# Altium schematic sheet Power_PMIC.SchDoc: Power PMIC
size A3; Date: Not used; ApprovedBy: Not used; CheckedBy: Not used; Author: Not used; CompanyName: STMicroelectronics; DrawnBy: Not used; Engineer: Not used; Organization: Not used; Address1: Not used; Address2: Not used; Address3: Not used; Address4: Not used; DocumentNumber: Not used; Revision: Not used; SheetNumber: 4; SheetTotal: 18; CurrentTime: Not used; CurrentDate: Not used; Time: Not used; DocumentFullPathAndName: Not used; DocumentName: Not used; ModifiedDate: Not used; ImagePath: Not used; ProjectName: Not used; Application_BuildNumber: Not used
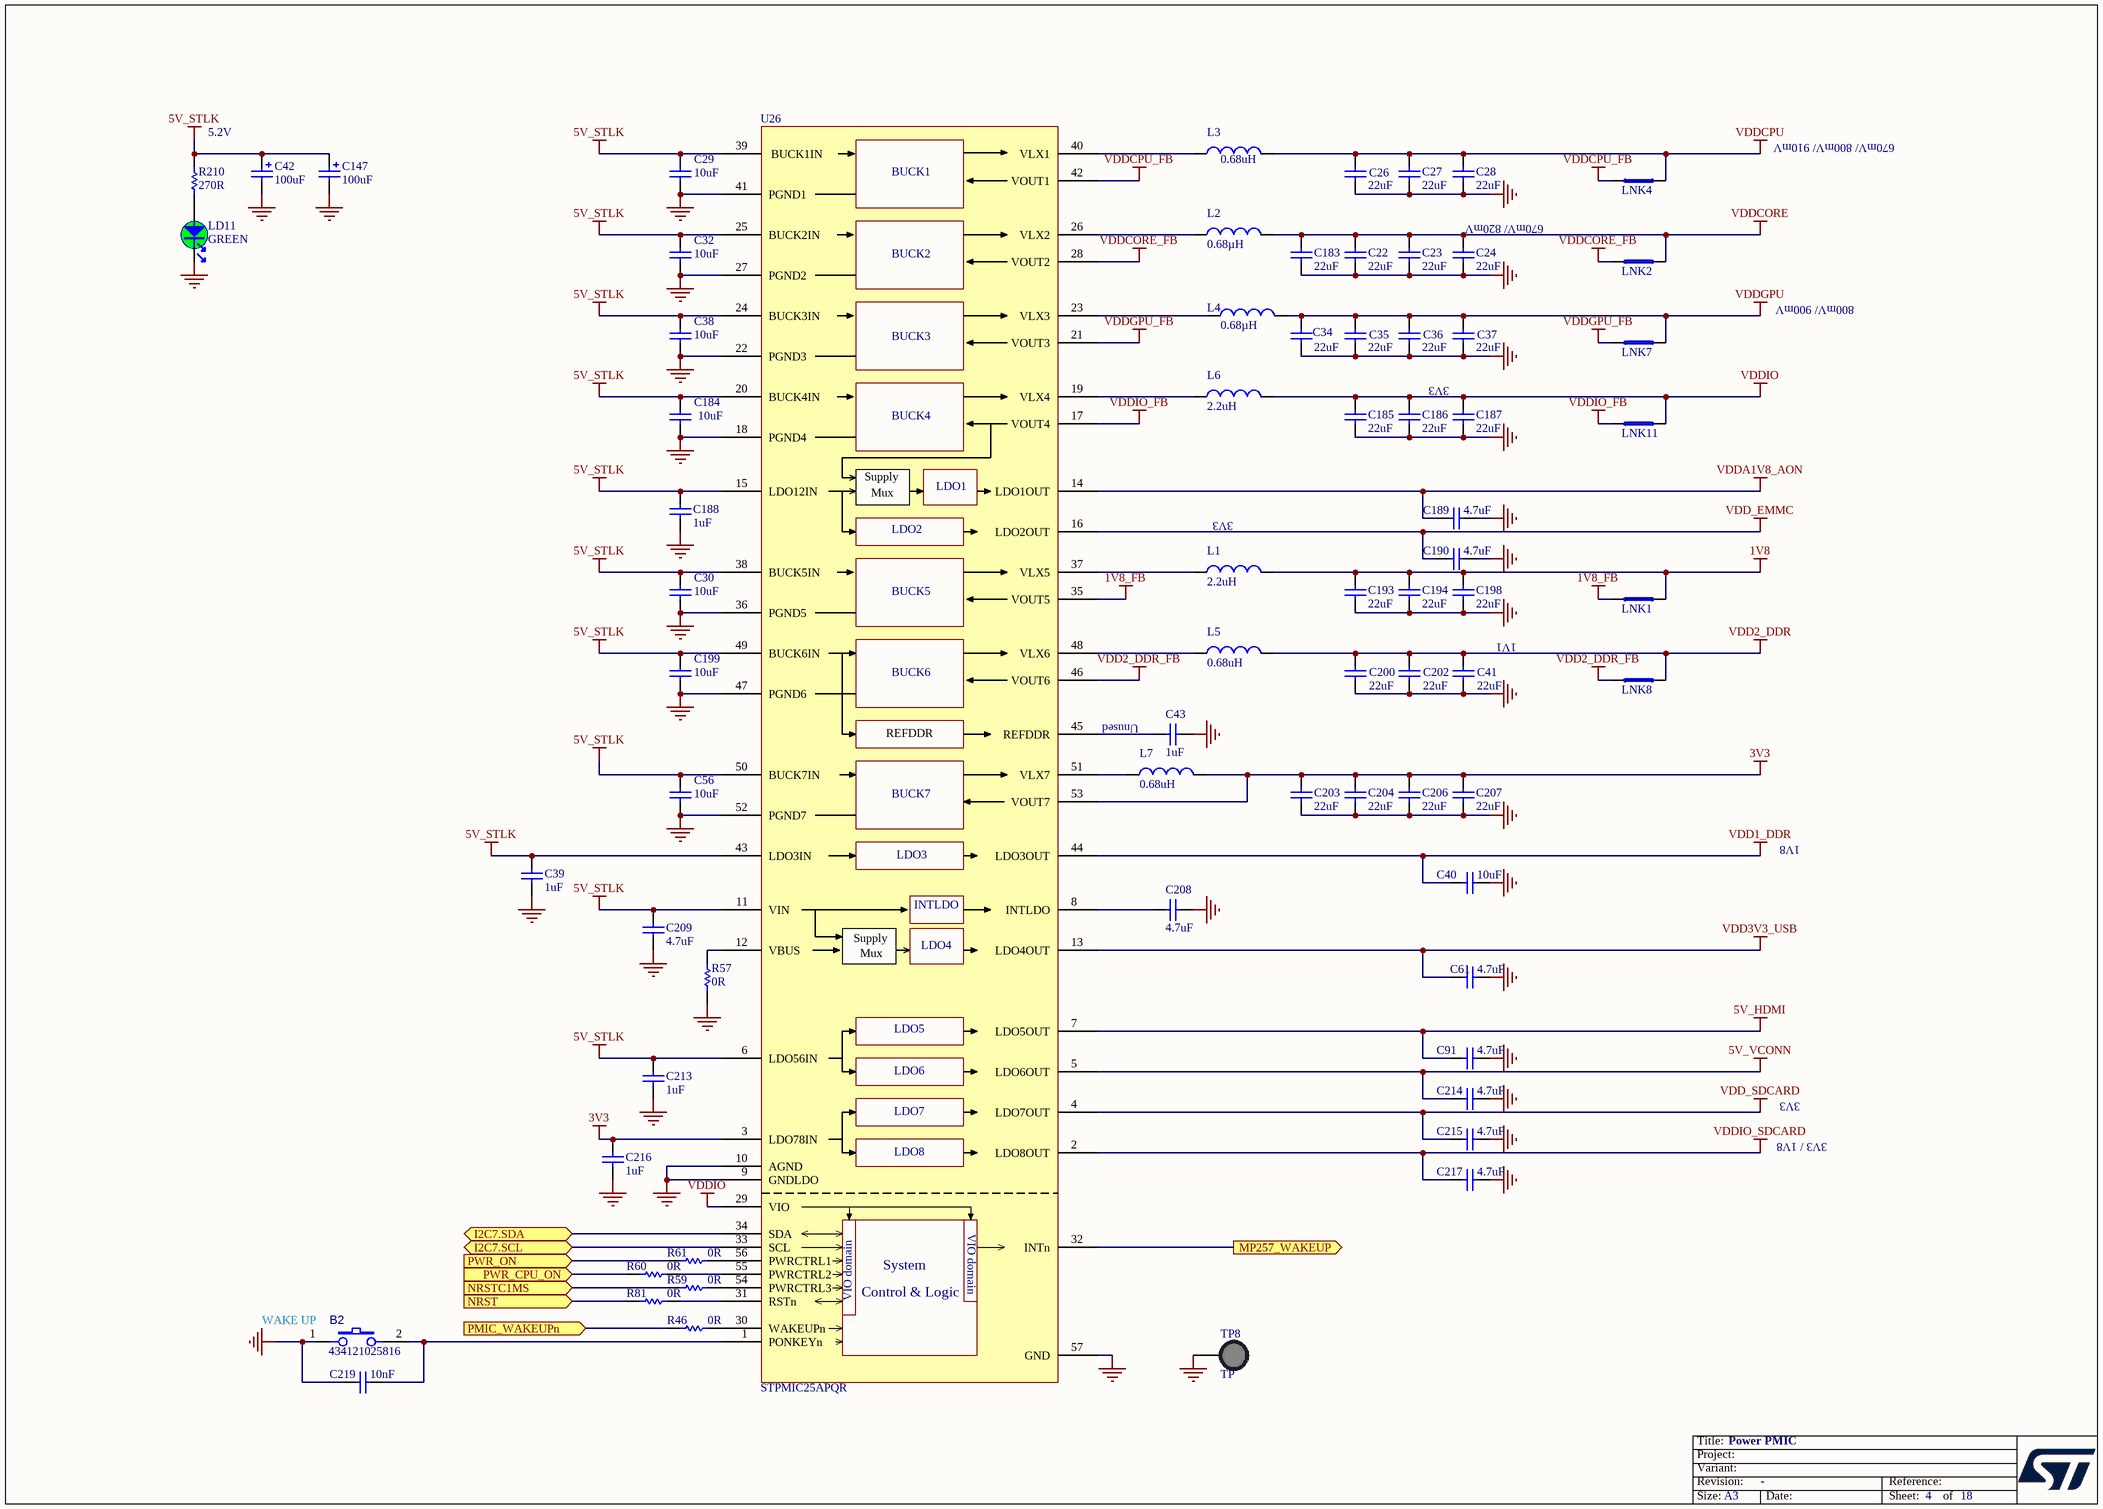
[diagram p0: Power_PMIC.SchDoc]

## Parts
B2  value 434121025816  [SWI_WE_434121025816]  (hidden comment: SW_PUSH_SMD_2P)
C22  value 22uF  [C0603]  (hidden comment: Capacitor)
C23  value 22uF  [C0603]  (hidden comment: Capacitor)
C24  value 22uF  [C0603]  (hidden comment: Capacitor)
C26  value 22uF  [C0603]  (hidden comment: Capacitor)
C27  value 22uF  [C0603]  (hidden comment: Capacitor)
C28  value 22uF  [C0603]  (hidden comment: Capacitor)
C29  value 10uF  [C0603]  (hidden comment: Capacitor)
C30  value 10uF  [C0603]  (hidden comment: Capacitor)
C32  value 10uF  [C0603]  (hidden comment: Capacitor)
C34  value 22uF  [C0603]  (hidden comment: Capacitor)
C35  value 22uF  [C0603]  (hidden comment: Capacitor)
C36  value 22uF  [C0603]  (hidden comment: Capacitor)
C37  value 22uF  [C0603]  (hidden comment: Capacitor)
C38  value 10uF  [C0603]  (hidden comment: Capacitor)
C39  value 1uF  [C0402]  (hidden comment: Capacitor)
C40  value 10uF  [C0402]  (hidden comment: Capacitor)
C41  value 22uF  [C0603]  (hidden comment: Capacitor)
C42  value 100uF  [CPOL_TCJ-B_1210_H210]  (hidden comment: Cap_POL_TANA)
C43  value 1uF  [C0402]  (hidden comment: Capacitor)
C56  value 10uF  [C0603]  (hidden comment: Capacitor)
C61  value 4.7uF  [C0402]  (hidden comment: Capacitor)
C91  value 4.7uF  [C0402]  (hidden comment: Capacitor)
C147  value 100uF  [CPOL_TCJ-B_1210_H210]  (hidden comment: Cap_POL_TANA)
C183  value 22uF  [C0603]  (hidden comment: Capacitor)
C184  value 10uF  [C0603]  (hidden comment: Capacitor)
C185  value 22uF  [C0805]  (hidden comment: Capacitor)
C186  value 22uF  [C0805]  (hidden comment: Capacitor)
C187  value 22uF  [C0805]  (hidden comment: Capacitor)
C188  value 1uF  [C0402]  (hidden comment: Capacitor)
C189  value 4.7uF  [C0402]  (hidden comment: Capacitor)
C190  value 4.7uF  [C0402]  (hidden comment: Capacitor)
C193  value 22uF  [C0805]  (hidden comment: Capacitor)
C194  value 22uF  [C0805]  (hidden comment: Capacitor)
C198  value 22uF  [C0805]  (hidden comment: Capacitor)
C199  value 10uF  [C0603]  (hidden comment: Capacitor)
C200  value 22uF  [C0603]  (hidden comment: Capacitor)
C202  value 22uF  [C0603]  (hidden comment: Capacitor)
C203  value 22uF  [C0805]  (hidden comment: Capacitor)
C204  value 22uF  [C0805]  (hidden comment: Capacitor)
C206  value 22uF  [C0805]  (hidden comment: Capacitor)
C207  value 22uF  [C0805]  (hidden comment: Capacitor)
C208  value 4.7uF  [C0402]  (hidden comment: Capacitor)
C209  value 4.7uF  [C0402]  (hidden comment: Capacitor)
C213  value 1uF  [C0402]  (hidden comment: Capacitor)
C214  value 4.7uF  [C0402]  (hidden comment: Capacitor)
C215  value 4.7uF  [C0402]  (hidden comment: Capacitor)
C216  value 1uF  [C0402]  (hidden comment: Capacitor)
C217  value 4.7uF  [C0402]  (hidden comment: Capacitor)
C219  value 10nF  [C0402]  (hidden comment: Capacitor)
L1  value 2.2uH  [IND_2016_MURATA_LQM2MPN2R2NG0]  (hidden comment: Inductor)
L2  value 0.68µH  [IND_2520_TOKO_DFE252012P]  (hidden comment: Inductor)
L3  value 0.68uH  [IND_2016_MURATA_LQM2MPN2R2NG0]  (hidden comment: Inductor)
L4  value 0.68µH  [IND_2520_TOKO_DFE252012P]  (hidden comment: Inductor)
L5  value 0.68uH  [IND_2016_MURATA_LQM2MPN2R2NG0]  (hidden comment: Inductor)
L6  value 2.2uH  [IND_2016_MURATA_LQM2MPN2R2NG0]  (hidden comment: Inductor)
L7  value 0.68uH  [IND_2016_MURATA_LQM2MPN2R2NG0]  (hidden comment: Inductor)
LD11  value GREEN  [LED_0603_OSRAM_LG-Q396-PS-35_GREEN_1A2K_H0P4]  (hidden comment: LED_green)
LNK1  link_200  [LINK200]  (value not drawn)  (no BOM)
LNK2  link_200  [LINK200]  (value not drawn)  (no BOM)
LNK4  link_200  [LINK200]  (value not drawn)  (no BOM)
LNK7  link_200  [LINK200]  (value not drawn)  (no BOM)
LNK8  link_200  [LINK200]  (value not drawn)  (no BOM)
LNK11  link_200  [LINK200]  (value not drawn)  (no BOM)
R46  value 0R  [R0402]
R57  value 0R  [R0402]
R59  value 0R  [R0402]
R60  value 0R  [R0402]
R61  value 0R  [R0402]
R81  value 0R  [R0402]
R210  value 270R  [R0402]  (hidden comment: Resistor)
TP8  value TP  [TP_PTH-1P02MM_TEST-TERMINAL_RS_101-2391_BLACK]  (hidden comment: Test_pin_conn_black)
U26  STPMIC25APQR  [ICC_QFN56-EPAD_6P5X6P5_P040]

## Ports
I2C7.SCL (bidir), I2C7.SDA (bidir), MP257_WAKEUP (out), NRST (in), NRSTC1MS (in), PMIC_WAKEUPn (in), PWR_CPU_ON (in), PWR_ON (in)

## Nets
1V8: C193.2 C194.2 C198.2 L1.2 LNK1.2
1V8_FB: LNK1.1 U26.35(VOUT5)
3V3: C203.2 C204.2 C206.2 C207.2 C216.2 L7.2 U26.3(LDO78IN) U26.53(VOUT7)
5V_HDMI: C91.1 U26.7(LDO5OUT)
5V_STLK: C29.2 C30.2 C32.2 C38.2 C39.2 C42.1 C56.2 C147.1 C184.2 C188.2 C199.2 C209.2 C213.2 R210.1 U26.6(LDO56IN) U26.11(VIN) U26.15(LDO12IN) U26.20(BUCK4IN) U26.24(BUCK3IN) U26.25(BUCK2IN) U26.38(BUCK5IN) U26.39(BUCK1IN) U26.43(LDO3IN) U26.49(BUCK6IN) U26.50(BUCK7IN)
5V_VCONN: C214.1 U26.5(LDO6OUT)
GND: B2.1 C22.1 C23.1 C24.1 C26.1 C27.1 C28.1 C29.1 C30.1 C32.1 C34.1 C35.1 C36.1 C37.1 C38.1 C39.1 C40.1 C41.1 C42.2 C43.1 C56.1 C61.1 C91.2 C147.2 C183.1 C184.1 C185.1 C186.1 C187.1 C188.1 C189.1 C190.2 C193.1 C194.1 C198.1 C199.1 C200.1 C202.1 C203.1 C204.1 C206.1 C207.1 C208.2 C209.1 C213.1 C214.2 C215.2 C216.1 C217.2 C219.1 LD11.2 R57.1 TP8.1 U26.9(GNDLDO) U26.10(AGND) U26.18(PGND4) U26.22(PGND3) U26.27(PGND2) U26.36(PGND5) U26.41(PGND1) U26.47(PGND6) U26.52(PGND7) U26.57(GND)
VDD1_DDR: C40.2 U26.44(LDO3OUT)
VDD2_DDR: C41.2 C200.2 C202.2 L5.2 LNK8.2
VDD2_DDR_FB: LNK8.1 U26.46(VOUT6)
VDD3V3_USB: C61.2 U26.13(LDO4OUT)
VDD_EMMC: C190.1 U26.16(LDO2OUT)
VDD_SDCARD: C215.1 U26.4(LDO7OUT)
VDDA1V8_AON: C189.2 U26.14(LDO1OUT)
VDDCORE: C22.2 C23.2 C24.2 C183.2 L2.2 LNK2.2
VDDCORE_FB: LNK2.1 U26.28(VOUT2)
VDDCPU: C26.2 C27.2 C28.2 L3.2 LNK4.1
VDDCPU_FB: LNK4.2 U26.42(VOUT1)
VDDGPU: C34.2 C35.2 C36.2 C37.2 L4.2 LNK7.2
VDDGPU_FB: LNK7.1 U26.21(VOUT3)
VDDIO: C185.2 C186.2 C187.2 L6.2 LNK11.2 U26.29(VIO)
VDDIO_FB: LNK11.1 U26.17(VOUT4)
VDDIO_SDCARD: C217.1 U26.2(LDO8OUT)
I2C7.SCL: U26.33(SCL) ; port I2C7.SCL
I2C7.SDA: U26.34(SDA) ; port I2C7.SDA
MP257_WAKEUP: U26.32(INTn) ; port MP257_WAKEUP
NRST: R81.1 ; port NRST
NRSTC1MS: R59.1 ; port NRSTC1MS
PMIC_WAKEUPn: R46.1 ; port PMIC_WAKEUPn
PWR_CPU_ON: R60.1 ; port PWR_CPU_ON
PWR_ON: R61.1 ; port PWR_ON
NetB2_2: B2.2 C219.2 U26.1(PONKEYn)
NetC43_2: C43.2 U26.45(REFDDR)
NetC208_1: C208.1 U26.8(INTLDO)
NetL1_1: L1.1 U26.37(VLX5)
NetL2_1: L2.1 U26.26(VLX2)
NetL3_1: L3.1 U26.40(VLX1)
NetL4_1: L4.1 U26.23(VLX3)
NetL5_1: L5.1 U26.48(VLX6)
NetL6_1: L6.1 U26.19(VLX4)
NetL7_1: L7.1 U26.51(VLX7)
NetLD11_1: LD11.1 R210.2
NetR46_2: R46.2 U26.30(WAKEUPn)
NetR57_2: R57.2 U26.12(VBUS)
NetR59_2: R59.2 U26.54(PWRCTRL3)
NetR60_2: R60.2 U26.55(PWRCTRL2)
NetR61_2: R61.2 U26.56(PWRCTRL1)
NetR81_2: R81.2 U26.31(RSTn)

## Notes on the sheet
- 5.2V
- 670mV/ 800mV/ 910mV
- (near C24) 670mV/ 820mV
- 800mV/ 900mV
- 3V3
- (near L1) 3V3
- 1V1
- Unused
- 1V8
- 3V3 / 1V8
- (near B2) WAKE UP
- Title:
- Project:
- Size:
- Revision:
- Variant:
- A3
- -
- Date:
- Reference:
- Sheet:
- of
- (in symbol MCD-03000) BUCK1; BUCK2; BUCK3; BUCK4; Supply; LDO1; Mux; LDO2; BUCK5; BUCK6; BUCK7; LDO3; LDO4; LDO5; LDO6; LDO7; LDO8; VIO domain; System; Control & Logic

## Library data of the parts
B2 = MCD-03492: Switch tactile, SPST-NO, 50mA, 12V, 6x3.8mm; Part_Type: Misc; Part_Preference: Recommended; Manufacturer: WURTH ELEKTRONIC; Component_Country_Of_Origin: China°; ShowFields: YES; ID: 5608; Internal_Part_Number: MCD-03492; Status: Checked; Manufacturer_Part_Number: 434121025816; Package: 6x3.8mm; ComponentLink1URL: http://tunmcdsvn.tun.st.com/Component_Documentation_Library/Trunk/Misc/WURTH_ELECTRONIK_434121025816; Order_Code_Digikey: 732-7045-2-ND; Order_Code_Farnell: 1867991; Order_Code_RS: N/A
C22-C24 C26 C34-C37 C41 C200 C202 = MCD-00100: Capacitor, MLCC, 22uF, 6V3, X5R, +/-20%, 0603, T=0,8mm; Manufacturer_Part_Number: GRM188R60J226MEA0J; Manufacturer: MURATA; Part_Preference: Recommended; Component_Country_Of_Origin: Japan; ID: 2766; ShowFields: YES; Internal_Part_Number: MCD-00100; Status: Released; Part_Type: Capacitor; Package: 0603; ComponentLink1Description: Part_Information; ComponentLink1URL: http://tunmcdsvn.tun.st.com/Component_Documentation_Library/Trunk/Capacitor/MURATA_GRM_Series; Order_Code_Digikey: 490-7612-2-ND; Order_Code_Farnell: N/A; Order_Code_RS: N/A; Alternate_Manufacturer: N/A; Alternate_Manufacturer_Part_Number: N/A
C27 C28 C183 = MCD-00100: Capacitor, MLCC, 22uF, 6V3, X5R, +/-20%, 0603, T=0,8mm; Part_Preference: Recommended; Manufacturer: MURATA; Manufacturer_Part_Number: GRM188R60J226MEA0J; Component_Country_Of_Origin: Japan; ID: 2766; ShowFields: YES; Internal_Part_Number: MCD-00100; Status: Released; Part_Type: Capacitor; Package: 0603; ComponentLink1URL: http://tunmcdsvn.tun.st.com/Component_Documentation_Library/Trunk/Capacitor/MURATA_GRM_Series; Order_Code_Digikey: 490-7612-2-ND; Order_Code_Farnell: N/A; Order_Code_RS: N/A; ComponentLink1Description: Part_Information; Alternate_Manufacturer: N/A; Alternate_Manufacturer_Part_Number: N/A
C29 C30 C32 C38 C56 C184 C199 = MCD-00099: Capacitor, MLCC, 10uF, 10V, X5R, +/-10%, 0603, T=0,8mm; Manufacturer_Part_Number: GRM188R61A106KE69D; Manufacturer: MURATA; Part_Preference: Recommended; Order_Code_RS: 170-6168; Component_Country_Of_Origin: Japan; ID: 2770; ShowFields: YES; Internal_Part_Number: MCD-00099; Status: Released; Part_Type: Capacitor; Package: 0603; ComponentLink1Description: Part_Information; ComponentLink1URL: http://tunmcdsvn.tun.st.com/Component_Documentation_Library/Trunk/Capacitor/MURATA_GRM_Series; Order_Code_Digikey: 490-10474-1-ND; Order_Code_Farnell: 2494233; Alternate_Manufacturer: N/A; Alternate_Manufacturer_Part_Number: N/A
C39 C43 C188 C213 C216 = MCD-00095: Capacitor, MLCC, 1uF, 25V, X5R, +/-10%, 0402, T=0.5mm; Part_Preference: Recommended; Manufacturer: MURATA; Manufacturer_Part_Number: GRM155R61E105KA12; Order_Code_RS: 846-7287; Component_Country_Of_Origin: Japan; ShowFields: YES; ID: 2772; Internal_Part_Number: MCD-00095; Status: Released; Part_Type: Capacitor; Package: 0402; ComponentLink1URL: http://tunmcdsvn.tun.st.com/Component_Documentation_Library/Trunk/Capacitor/MURATA_GRM_Series; Order_Code_Digikey: 490-10017-1-ND; Order_Code_Farnell: 2218855
C40 = MCD-03140: Capacitor, MLCC, 10uF, 6.3V, X5R, +/-20%, 0402, T=0.5mm; Part_Preference: Recommended; Manufacturer: MURATA; Manufacturer_Part_Number: GRM155R60J106ME05D; ShowFields: YES; ID: 5256; Component_Country_Of_Origin: China, Japan; Internal_Part_Number: MCD-03140; Status: Checked; Part_Type: Capacitor; Package: 0402; ComponentLink1URL: http://tunmcdsvn.tun.st.com/Component_Documentation_Library/Trunk/Capacitor/MURATA_GRM_Series; Order_Code_Digikey: 490-GRM155R60J106ME05DTR-ND; Order_Code_Farnell: 3784428; Order_Code_RS: N/A
C42 C147 = MCD-01796: Capacitor, Tantalum, 100uF, 6V3, 40mR, +/-20%,  Type_B (3528 metric), T=1.9mm; Part_Preference: Recommended; Manufacturer: AVX; Manufacturer_Part_Number: TCJB107M006R0040; Component_Country_Of_Origin: Lanskroun; ShowFields: YES; ID: 3896; Revision: July-2002: Re-released for DXP Platform.; Internal_Part_Number: MCD-01796; Status: Released; Part_Type: Capacitor; Package: 3528 (metric); ComponentLink1URL: http://tunmcdsvn.tun.st.com/Component_Documentation_Library/Trunk/Capacitor/AVX_TCJ_Series; Order_Code_Digikey: 478-9994-2-ND; Order_Code_Farnell: 2728622; Order_Code_RS: N/A
C61 C91 C189 C190 C208 C209 C214 C215 C217 = MCD-01356: Capacitor, MLCC, 4.7uF, 6V3, X5R, +/-20%, 0402, T=0.5mm; Manufacturer_Part_Number: GRM155R60J475ME47; Manufacturer: MURATA; Part_Preference: Recommended; Order_Code_RS: 814-5230; Component_Country_Of_Origin: Japan; ShowFields: YES; ID: 3456; Internal_Part_Number: MCD-01356; Status: Released; Part_Type: Capacitor; Package: 0402; ComponentLink1URL: http://tunmcdsvn.tun.st.com/Component_Documentation_Library/Trunk/Capacitor/MURATA_GRM_Series; Order_Code_Digikey: 490-5915-1-ND; Order_Code_Farnell: 2666407
C185-C187 C193 C194 C198 C203 C204 C206 C207 = MCD-03139: Capacitor, MLCC, 22uF, 10V, X5R, +/-20%, 0805, T=1,25mm; Part_Preference: Recommended; Manufacturer: MURATA; Manufacturer_Part_Number: GRM21BR61A226ME51L; ShowFields: YES; ID: 5255; Component_Country_Of_Origin: China, Japan; Internal_Part_Number: MCD-03139; Status: Checked; Part_Type: Capacitor; Package: 0805; ComponentLink1URL: http://tunmcdsvn.tun.st.com/Component_Documentation_Library/Trunk/Capacitor/MURATA_GRM_Series; Order_Code_Digikey: 490-10511-2-ND; Order_Code_Farnell: 2494270; Order_Code_RS: N/A
C219 = MCD-02198: Capacitor, MLCC, 10nF, 50V, X7R, +/-10%, 0402, T=0.5mm; Manufacturer_Part_Number: CC0402KRX7R9BB103; Manufacturer: YAGEO; Part_Preference: Recommended; Order_Code_RS: 6169644; Component_Country_Of_Origin: China; ShowFields: YES; ID: 4298; Internal_Part_Number: MCD-02198; Status: Checked; Part_Type: Capacitor; Package: 0402; ComponentLink1URL: http://tunmcdsvn.tun.st.com/Component_Documentation_Library/Trunk/Capacitor/YAGEO_X7R_Series; Order_Code_Digikey: N/A; Order_Code_Farnell: N/A
L1 L6 = MCD-03143: Inductor, 2.2uH, +/-20%, Itemp= 1700mA, Isat= 2400mA, 0R140, 0806, T=1mm; Part_Preference: Recommended; Manufacturer: MURATA; Manufacturer_Part_Number: DFE201610E-2R2M=P2; ShowFields: YES; ID: 5259; Component_Country_Of_Origin: Vietnam; Internal_Part_Number: MCD-03143; Status: Checked; Part_Type: Inductor; Package: 0806; ComponentLink1URL: http://tunmcdsvn.tun.st.com/Component_Documentation_Library/Trunk/Inductor/MURATA_DFE201610E_Series; Order_Code_Digikey: 490-17728-2-ND -; Order_Code_Farnell: N/A; Order_Code_RS: N/A
L2 L4 = MCD-03142: Inductor, 0.68uH, +/-20%, Itemp= 3900mA, Isat= 5400mA, 0R031, 1008, T=1.2mm; Part_Preference: Recommended; Manufacturer: MURATA; Manufacturer_Part_Number: DFE252012F-R68M=P2; ShowFields: YES; ID: 5258; Component_Country_Of_Origin: Vietnam; Internal_Part_Number: MCD-03142; Status: Checked; Part_Type: Inductor; Package: 1008; ComponentLink1URL: http://tunmcdsvn.tun.st.com/Component_Documentation_Library/Trunk/Inductor/MURATA_DFE252012F-6R8M=P2; Order_Code_Digikey: 490-13044-2-ND; Order_Code_Farnell: N/A; Order_Code_RS: N/A
L3 L5 L7 = MCD-03141: Inductor, 0.68uH, +/-20%, Itemp= 3100mA, Isat= 4300mA, 0R043, 0806, T=1mm; Part_Preference: Recommended; Manufacturer: MURATA; Manufacturer_Part_Number: DFE201610E-R68M=P2; ShowFields: YES; ID: 5257; Component_Country_Of_Origin: Vietnam; Internal_Part_Number: MCD-03141; Status: Checked; Part_Type: Inductor; Package: 0806; ComponentLink1URL: http://tunmcdsvn.tun.st.com/Component_Documentation_Library/Trunk/Inductor/MURATA_DFE201610E_Series; Order_Code_Digikey: N/A; Order_Code_Farnell: N/A; Order_Code_RS: N/A
LD11 = MCD-00588: LED Green, 0603 SMD, Forward Voltage Typ=2V, Max=2.5V; Part_Type: Display; Manufacturer_Part_Number: LG Q396-PS-35; Manufacturer: OSRAM OPTO SEMICONDUCTORS; Alternate_Manufacturer_Part_Number: VLMTG1300-GS08; Alternate_Manufacturer: VISHAY SEMICONDUCTOR OPTO DIVISION; Alternate_Internal_Part_Number: MCD-02400; Part_Preference: Recommended; Provided_By: SUBCO; Component_Country_Of_Origin: Unknown; ID: 3155; ShowFields: YES; Internal_Part_Number: MCD-00588; Status: Released; Package: LED 0603; ComponentLink1Description: Datasheet; ComponentLink1URL: http://tunmcdsvn.tun.st.com/Component_Documentation_Library/Trunk/Display/OSRAM_OPTO_SEMICONDUCTORS_LG-Q396-PS-35; Order_Code_Digikey: LG Q396-PS-35-ND; ECCN_US: n/a; ECCN_EU: n/a; Order_Code_Farnell: N/A; Order_Code_RS: N/A; Full_Alternate_Internal_Part_Number: MCD-02400
LNK1 LNK2 LNK4 LNK7 LNK8 LNK11 = MCD-02777: Track link on PCB 200um width for layout routing; Part_Preference: Recommended; Part_Type: Misc; ID: 4889; ShowFields: YES; Value: link_200; ComponentLink1URL: http://tunmcdsvn.tun.st.com/Component_Documentation_Library/Trunk; Internal_Part_Number: MCD-02777; Manufacturer: N/A; Manufacturer_Part_Number: link_200; Order_Code_Digikey: N/A; Order_Code_Farnell: N/A; Order_Code_RS: N/A; Status: Checked
R46 R57 R59-R61 R81 = MCD-00052: Resistor,0R,0402,5%,1/16W; Manufacturer_Part_Number: RC0402JR-070RL; Manufacturer: YAGEO; Part_Preference: Recommended; ECCN_US: EAR99; ECCN_EU: NEC; Provided_By: SUBCO; Initial_Board_Reference: mb1274; Order_Code_RS: 618-5804; Component_Country_Of_Origin: China; ID: 2540; ShowFields: YES; Internal_Part_Number: MCD-00052; ComponentLink1Description: Datasheet; Status: Released; Part_Type: Resistor; ComponentLink1URL: http://tunmcdsvn.tun.st.com/Component_Documentation_Library/Trunk/Resistor/YAGEO_RC_L_Series; Package: 0402; Alternate_Manufacturer: N/A; Alternate_Manufacturer_Part_Number: N/A; Order_Code_Digikey: 311-0.0JRCT-ND; Order_Code_Farnell: 9232516RL
R210 = MCD-00441: Resistor,270R,0402,1%,1/16W; Manufacturer_Part_Number: RC0402FR-07270RL; Manufacturer: YAGEO; Part_Preference: Recommended; Provided_By: SUBCO; ECCN_US: EAR99; ECCN_EU: NEC; Component_Country_Of_Origin: China; ID: 2838; ShowFields: YES; Internal_Part_Number: MCD-00441; Status: Released; Part_Type: Resistor; Package: 0402; ComponentLink1Description: Datasheet; ComponentLink1URL: http://tunmcdsvn.tun.st.com/Component_Documentation_Library/Trunk/Resistor/YAGEO_RC_L_Series; Order_Code_Digikey: 311-270LRCT-ND; Order_Code_Farnell: 9239162; Order_Code_RS: N/A
TP8 = MCD-00713: Vero Technologies 1.02mm Black Terminal Post; Part_Type: Misc; Manufacturer_Part_Number: 20-2137; Part_Preference: Recommended; Order_Code_RS: 101-2391; Component_Country_Of_Origin: United Kingdom; ID: 3032; ShowFields: YES; Internal_Part_Number: MCD-00713; Status: Released; Manufacturer: VERO; ComponentLink1URL: http://tunmcdsvn.tun.st.com/Component_Documentation_Library/Trunk/Misc/VERO_20-2137; Order_Code_Digikey: N/A; Order_Code_Farnell: N/A
U26 = MCD-03000: STPMIC2; Part_Type: IC; Part_Preference: Recommended; Manufacturer: STMICROELECTRONICS; Component_Country_Of_Origin: Unknown; ShowFields: YES; ID: 5116; ComponentLink1Description: Datasheet; ComponentLink1URL: http://tunmcdsvn.tun.st.com/Component_Documentation_Library/Trunk/IC/STMICROELECTRONICS_STPMIC2; Internal_Part_Number: MCD-03000; Value: STPMIC25APQR; Status: Released; Manufacturer_Part_Number: STPMIC25APQR; Package: VQFN; Order_Code_Digikey: N/A; Order_Code_Farnell: N/A; Order_Code_RS: N/A